# Altium schematic sheet Condor2_NTEL_REV_C.SchDoc
size A4; DrawnBy: Philip Rowse

## Notes on the sheet
- Title:
- Date:
- Time:
- https://creativecommons.org/publicdomain/zero/1.0/
- Sheet:
- Approved:
- of:
- Drawn By:
- Checked By:
- ProfiCNC